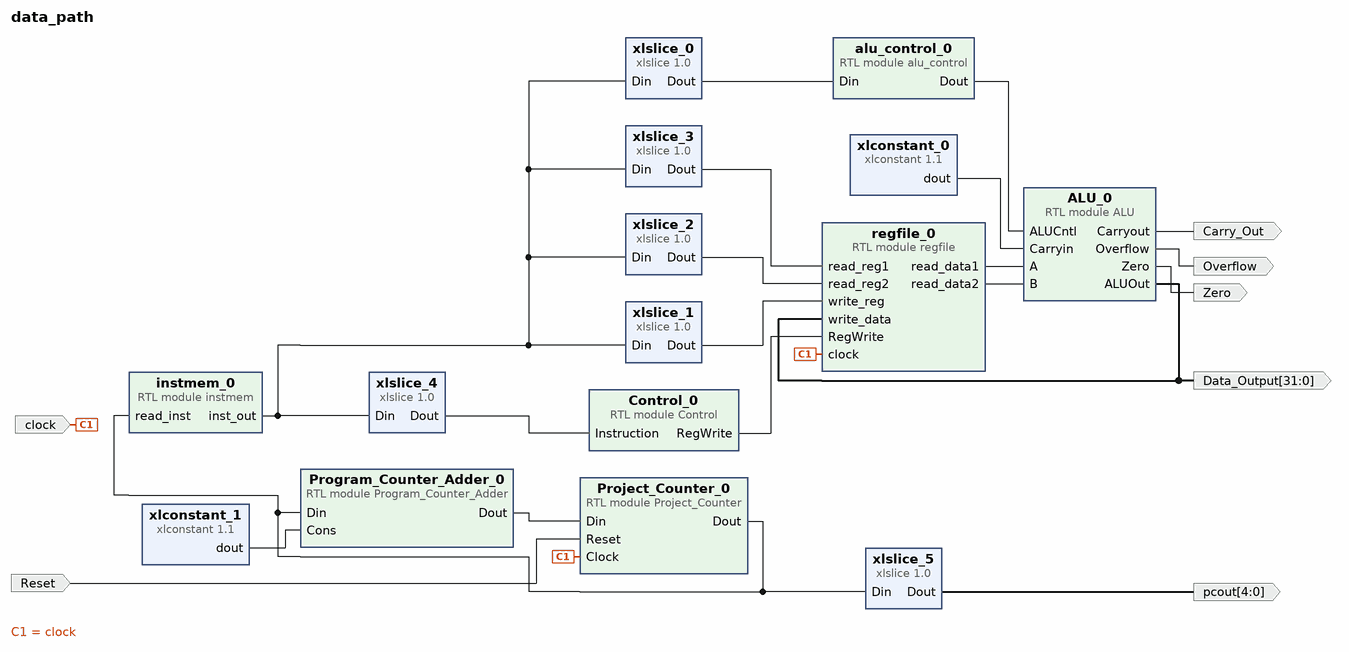
[diagram p0: block diagram of the top level]
# Vivado block design data_path, xc7a35tcpg236-1, Vivado 2019.1
create_bd_design data_path

create_bd_port -dir I -type rst Reset
set_property -dict {CONFIG.POLARITY ACTIVE_HIGH} [get_bd_ports Reset]
create_bd_port -dir O -from 31 -to 0 -type data Data_Output
create_bd_port -dir O -type data Zero
create_bd_port -dir O -type data Carry_Out
create_bd_port -dir O -type data Overflow
create_bd_port -dir I clock
create_bd_port -dir O -from 4 -to 0 pcout

create_bd_cell -type module -reference regfile regfile_0
create_bd_cell -type ip -vlnv xilinx.com:ip:xlslice:1.0 xlslice_0
set_property -dict {CONFIG.DIN_FROM 5 CONFIG.DOUT_WIDTH 6} [get_bd_cells xlslice_0]
create_bd_cell -type ip -vlnv xilinx.com:ip:xlslice:1.0 xlslice_1
set_property -dict {CONFIG.DIN_FROM 15 CONFIG.DIN_TO 11 CONFIG.DOUT_WIDTH 5} [get_bd_cells xlslice_1]
create_bd_cell -type ip -vlnv xilinx.com:ip:xlslice:1.0 xlslice_2
set_property -dict {CONFIG.DIN_FROM 20 CONFIG.DIN_TO 16 CONFIG.DOUT_WIDTH 5} [get_bd_cells xlslice_2]
create_bd_cell -type ip -vlnv xilinx.com:ip:xlslice:1.0 xlslice_3
set_property -dict {CONFIG.DIN_FROM 25 CONFIG.DIN_TO 21 CONFIG.DOUT_WIDTH 5} [get_bd_cells xlslice_3]
create_bd_cell -type ip -vlnv xilinx.com:ip:xlslice:1.0 xlslice_4
set_property -dict {CONFIG.DIN_FROM 31 CONFIG.DIN_TO 26 CONFIG.DOUT_WIDTH 6} [get_bd_cells xlslice_4]
create_bd_cell -type ip -vlnv xilinx.com:ip:xlconstant:1.1 xlconstant_0
set_property -dict {CONFIG.CONST_VAL 0} [get_bd_cells xlconstant_0]
create_bd_cell -type ip -vlnv xilinx.com:ip:xlconstant:1.1 xlconstant_1
set_property -dict {CONFIG.CONST_VAL 4 CONFIG.CONST_WIDTH 8} [get_bd_cells xlconstant_1]
create_bd_cell -type module -reference Control Control_0
create_bd_cell -type module -reference Project_Counter Project_Counter_0
create_bd_cell -type module -reference Program_Counter_Adder Program_Counter_Adder_0
create_bd_cell -type module -reference alu_control alu_control_0
create_bd_cell -type module -reference ALU ALU_0
create_bd_cell -type ip -vlnv xilinx.com:ip:xlslice:1.0 xlslice_5
set_property -dict {CONFIG.DIN_FROM 6 CONFIG.DIN_TO 2 CONFIG.DOUT_WIDTH 5} [get_bd_cells xlslice_5]
create_bd_cell -type module -reference instmem instmem_0

# ---- connections ----

connect_bd_net -net Project_Counter_0_Output [get_bd_pins Project_Counter_0/Dout] \
  [get_bd_pins Program_Counter_Adder_0/Din] [get_bd_pins xlslice_5/Din] [get_bd_pins instmem_0/read_inst]
connect_bd_net [get_bd_ports clock] [get_bd_pins regfile_0/clock] [get_bd_pins Project_Counter_0/Clock]
connect_bd_net [get_bd_pins Control_0/RegWrite] [get_bd_pins regfile_0/RegWrite]
connect_bd_net [get_bd_pins alu_control_0/Dout] [get_bd_pins ALU_0/ALUCntl]
connect_bd_net [get_bd_pins regfile_0/read_data1] [get_bd_pins ALU_0/A]
connect_bd_net [get_bd_pins regfile_0/read_data2] [get_bd_pins ALU_0/B]
connect_bd_net [get_bd_pins ALU_0/ALUOut] [get_bd_pins regfile_0/write_data] [get_bd_ports Data_Output]
connect_bd_net [get_bd_ports Reset] [get_bd_pins Project_Counter_0/Reset]
connect_bd_net [get_bd_pins ALU_0/Zero] [get_bd_ports Zero]
connect_bd_net [get_bd_pins ALU_0/Carryout] [get_bd_ports Carry_Out]
connect_bd_net [get_bd_pins ALU_0/Overflow] [get_bd_ports Overflow]
connect_bd_net [get_bd_pins instmem_0/inst_out] \
  [get_bd_pins xlslice_0/Din] [get_bd_pins xlslice_1/Din] [get_bd_pins xlslice_2/Din] [get_bd_pins xlslice_3/Din] \
  [get_bd_pins xlslice_4/Din]
connect_bd_net [get_bd_pins xlslice_0/Dout] [get_bd_pins alu_control_0/Din]
connect_bd_net [get_bd_pins xlslice_1/Dout] [get_bd_pins regfile_0/write_reg]
connect_bd_net [get_bd_pins xlslice_2/Dout] [get_bd_pins regfile_0/read_reg2]
connect_bd_net [get_bd_pins xlslice_3/Dout] [get_bd_pins regfile_0/read_reg1]
connect_bd_net [get_bd_pins xlslice_4/Dout] [get_bd_pins Control_0/Instruction]
connect_bd_net [get_bd_pins xlconstant_0/dout] [get_bd_pins ALU_0/Carryin]
connect_bd_net [get_bd_pins xlconstant_1/dout] [get_bd_pins Program_Counter_Adder_0/Cons]
connect_bd_net [get_bd_pins Program_Counter_Adder_0/Dout] [get_bd_pins Project_Counter_0/Din]
connect_bd_net [get_bd_pins xlslice_5/Dout] [get_bd_ports pcout]

validate_bd_design
save_bd_design
